# EAGLE design vlpf (EAGLE 7.2.0)
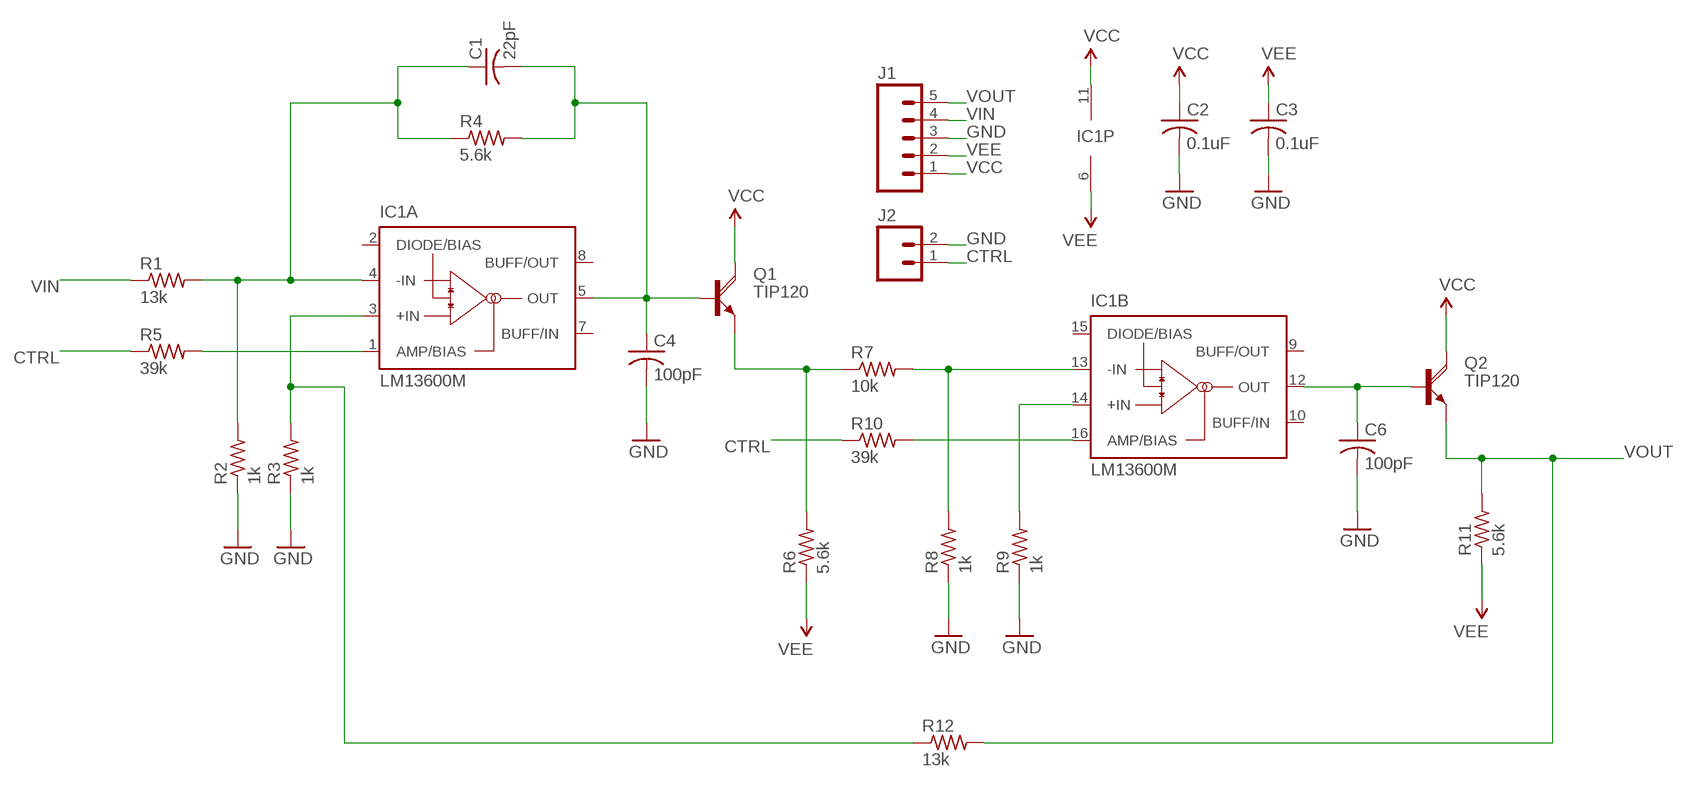
[diagram p0: schematic, sheet 1]

## Parts
C1  22pF  C-USC0504  [C0504]
C2  0.1uF  C-USC0504  [C0504]
C3  0.1uF  C-USC0504  [C0504]
C4  100pF  C-USC0504  [C0504]
C6  100pF  C-USC0504  [C0504]
IC1  LM13600M  [SO16]
J1  M05PTH  [1X05]
J2  M02PTH  [1X02]
Q1  TIP120  [TO220AH]
Q2  TIP120  [TO220AH]
R1  13k  R-US_R0402  [R0402]
R2  1k  R-US_R0402  [R0402]
R3  1k  R-US_R0402  [R0402]
R4  5.6k  R-US_R0402  [R0402]
R5  39k  R-US_R0402  [R0402]
R6  5.6k  R-US_R0402  [R0402]
R7  10k  R-US_R0402  [R0402]
R8  1k  R-US_R0402  [R0402]
R9  1k  R-US_R0402  [R0402]
R10  39k  R-US_R0402  [R0402]
R11  5.6k  R-US_R0402  [R0402]
R12  13k  R-US_R0402  [R0402]

## Nets
CTRL: J2.1 R5.1 R10.1
GND: C2.2 C3.2 C4.2 C6.2 J1.3 J2.2 R2.1 R3.1 R8.1 R9.1
N$1: C1.1 IC1.4(A:-IN) R1.2 R2.2 R4.1
N$2: IC1.3(A:+IN) R3.2 R12.1
N$3: C1.2 C4.1 IC1.5(A:OUT) Q1.B R4.2
N$4: IC1.1(A:AMP/BIAS) R5.2
N$5: Q1.E R6.2 R7.1
N$6: IC1.13(B:-IN) R7.2 R8.2
N$7: IC1.14(B:+IN) R9.2
N$8: IC1.16(B:AMP/BIAS) R10.2
N$9: C6.1 IC1.12(B:OUT) Q2.B
VCC: C2.1 IC1.11(P:V+) J1.1 Q1.C Q2.C R6.1 R11.1 ; supply symbol labelled VEE
VEE: C3.1 IC1.6(P:V-) J1.2
VIN: J1.4 R1.1
VOUT: J1.5 Q2.E R11.2 R12.2
Unconnected: IC1.2(A:DIODE/BIAS) IC1.7(A:BUFF/IN) IC1.8(A:BUFF/OUT) IC1.9(B:BUFF/OUT) IC1.10(B:BUFF/IN) IC1.15(B:DIODE/BIAS)

## Library data of the parts
C1-C4 C6 = adafruit:C-US: CAPACITOR, American symbol
IC1 = national-semiconductor:LM13600: Dual Operational Transconductance Amplifiers with Linearizing Diodes and Buffers Source: lm13600.PDF
J1 = SparkFun-Connectors:M05: Header 5 Standard 5-pin 0.1" header. Use with straight break away headers (SKU : PRT-00116), right angle break away headers (PRT-00553), swiss pins (PRT-00743), machine pins (PRT-00117), and female headers (PRT-00115). Molex polarized connector foot print use with SKU : PRT-08230 with associated crimp pins and housings.
J2 = SparkFun-Connectors:M02: Standard 2-pin 0.1" header. Use with - straight break away headers ( PRT-00116) - right angle break away headers (PRT-00553) - swiss pins (PRT-00743) - machine pins (PRT-00117) - female headers (PRT-00115) Molex polarized connector foot print use with: PRT-08233 with associated crimp pins and housings. 2.54_SCREWTERM for use with PRT-10571. 3.5mm Screw Terminal footprints for PRT-08084 5mm Screw Terminal footprints for use with PRT-08432
Q1 Q2 = transistor-power:TIP120: NPN DARLINGTON TRANSISTOR
R1-R12 = adafruit:R-US_: RESISTOR, American symbol

## Board
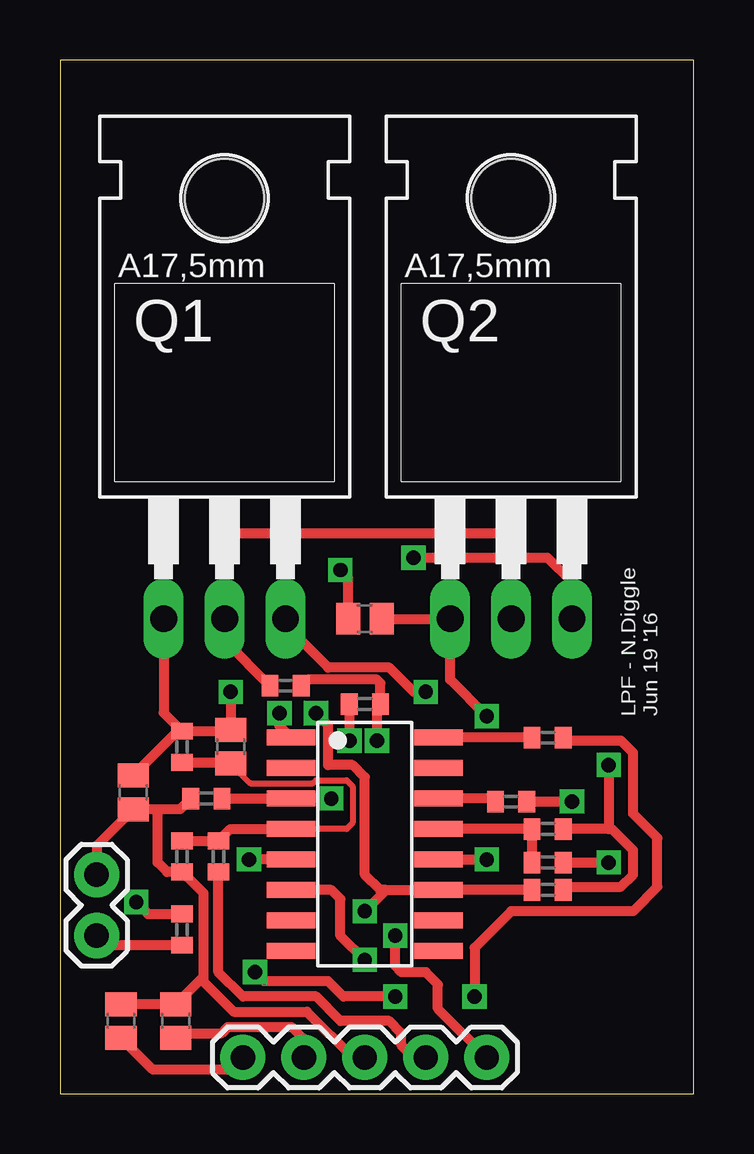
[diagram p1: board, top side]
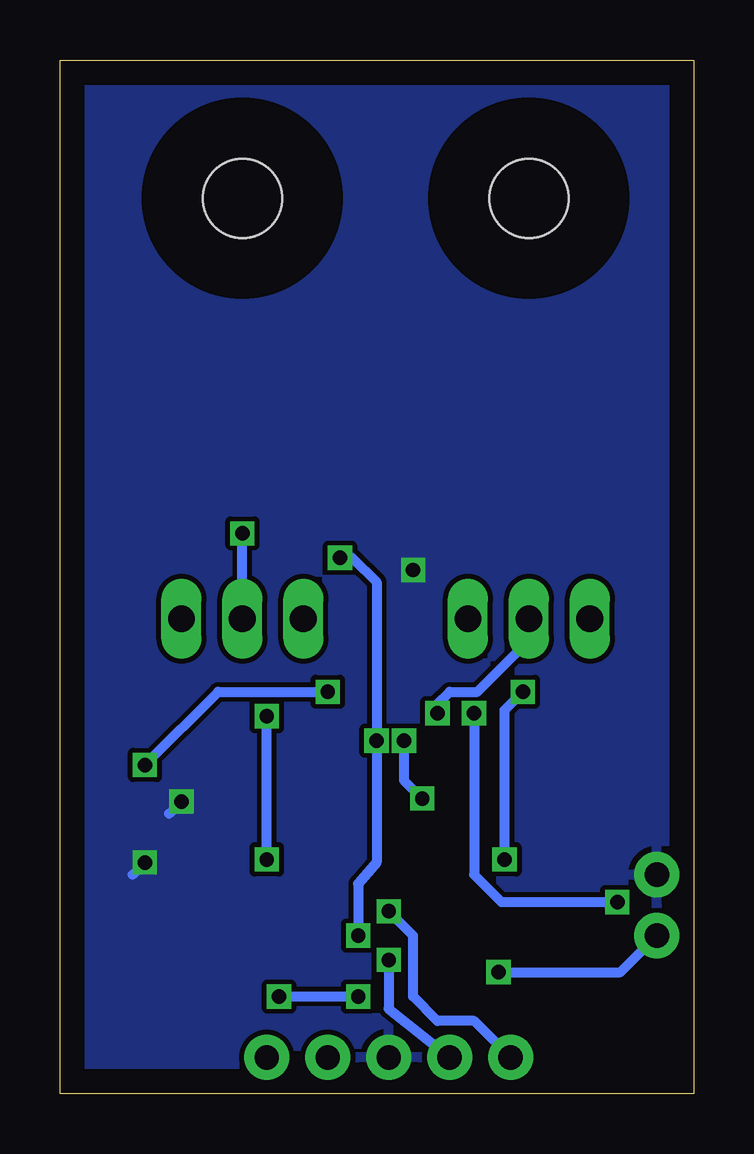
[diagram p2: board, bottom side, seen from below]

Size 26.4 x 43.1 mm. Coordinates in mm from the lower left corner, seen from the top.
Outline: 0,0 26.4,0 26.4,43.1 0,43.1 0,0
Copper layers (1*16): Top 0.035mm / dielectric 1.5mm / Bottom 0.035mm
Design rules "default": minimum track width 10mil, minimum drill 24mil, track to track 8mil, track to pad 8mil, pad to pad 8mil, via to via 8mil, smd to smd 8mil, copper to edge 40mil, drill to drill 8mil, minimum pad ring 10mil, minimum via ring 8mil, stop-mask expansion 4mil, vias tented up to drill 0mil, thermal gap 10mil

### Footprints (pad centres in the part's own frame; a part is rotated, then mirrored left to right if it is on the bottom)
C0504 = smd 1 x 1.3: 1 -0.7,0; 2 0.7,0
SO16 = smd 0.66 x 2.032: 1 -4.445,-3.073; 2 -3.175,-3.073; 3 -1.905,-3.073; 4 -0.635,-3.073; 5 0.635,-3.073; 6 1.905,-3.073; 7 3.175,-3.073; 8 4.445,-3.073; 9 4.445,3.073; 10 3.175,3.073; 11 1.905,3.073; 12 0.635,3.073; 13 -0.635,3.073; 14 -1.905,3.073; 15 -3.175,3.073; 16 -4.445,3.073
1X05 = drill 1.016 pad 1.88: 1 0,0; 2 2.54,0; 3 5.08,0; 4 7.62,0; 5 10.16,0
1X02 = drill 1.016 pad 1.88: 1 0,0; 2 2.54,0
TO220AH = drill 1.118 long: B -2.54,-6.35; C 0,-6.35; E 2.54,-6.35 | hole 3.302: 0,11.176
R0402 = smd 0.7 x 0.9: 1 -0.65,0; 2 0.65,0

### Placement (x,y rotation side)
C1  7.11,14.48 90 top
C2  2.54,3.05 90 top
C3  4.83,3.05 90 top
C4  3.05,12.57 270 top
C6  12.7,19.81 180 top
IC1  12.7,10.41 270 top
J1  7.62,1.52 0 top
J2  1.52,6.6 90 top
Q1  6.86,26.16 0 top
Q2  18.8,26.16 0 top
R1  6.6,9.91 90 top
R2  5.08,9.91 90 top
R3  6.1,12.32 0 top
R4  5.08,14.48 90 top
R5  5.08,6.86 90 top
R6  20.32,8.51 0 top
R7  20.32,11.05 180 top
R8  20.32,9.65 180 top
R9  18.8,12.19 180 top
R10  20.32,14.86 180 top
R11  9.4,17.02 0 top
R12  12.7,16.26 0 top

### Tracks (layer width: path | path; a pad name or v marks a point on that pad's centre or on a via)
CTRL  (via drill 0.6)
  Top 0.406: R5.1 1.92,6.21 J2.1 | R10.1 21.1,14.73 23.37,14.73 23.88,14.22 23.88,11.68 24.89,10.67 24.89,8.64 23.88,7.62 18.8,7.62 17.27,6.1 v17.27,4.06 | v13.97,4.06 11.81,4.06 11.18,4.7 8.51,4.7 v8.13,5.08
  Bottom 0.406: v17.27,4.06 v13.97,4.06 | v8.13,5.08 3.05,5.08 J2.1
GND  (via drill 0.6)
  Top 0.406: C2.2 C3.2 5.97,4.89 | 5.97,4.89 5.97,8.38 5.09,9.26 R2.1 4.46,9.26 4.06,9.65 4.06,11.87 | J2.2 1.52,10.35 C4.2 4.06,11.87 | R3.1 5,11.87 4.06,11.87 | C6.2 12,21.53 v11.68,21.84 | R8.1 v22.86,9.65 | R9.1 v21.34,12.19 | J1.3 12.19,1.52 10.29,3.43 7.24,3.43 5.97,4.7 5.97,4.89
  Bottom 0.406: v22.86,9.65 23.37,9.14 | v21.34,12.19 21.84,11.68
  pour Bottom: -0.51,-0.51 26.92,-0.51 26.92,43.69 -0.51,43.69
N$1
  Top 0.254: C1.1 7.94,12.95 10.54,12.95 10.67,13.08 11.94,13.08 12.19,12.83 12.19,11.3 11.94,11.05 IC1.4
  Top 0.406: IC1.4 7.1,11.05 R1.2 R2.2 | R4.1 7.06,13.83 C1.1
N$2  (via drill 0.6)
  Top 0.406: R3.2 IC1.3 v11.3,12.32 | R12.1 12.05,14.97 v12.06,14.73
  Bottom 0.406: v12.06,14.73 12.06,13.08 v11.3,12.32
N$3  (via drill 0.6)
  Top 0.406: R4.2 4.9,15.13 C4.1 | R4.2 7.06,15.13 C1.2 v7.11,16.76 | Q1.B 4.32,15.89 R4.2 | IC1.5 v7.87,9.78
  Bottom 0.406: v7.87,9.78 7.87,16 v7.11,16.76
N$4  (via drill 0.6)
  Top 0.406: IC1.1 9.14,15.34 v9.14,15.88 | v3.17,8 3.67,7.51 R5.2
  Bottom 0.406: v9.14,15.88 9.14,9.14 8,8 v3.17,8
N$5  (via drill 0.6)
  Top 0.406: R6.2 21.1,8.64 23.37,8.64 23.88,9.14 23.88,10.16 22.99,11.05 22.86,11.05 | 22.86,11.05 R7.1 | v15.24,16.76 14.73,16.76 13.72,17.78 11.18,17.78 9.4,19.56 Q1.E | v22.86,13.72 22.86,11.05
  Bottom 0.406: v22.86,13.72 19.81,16.76 v15.24,16.76
N$6
  Top 0.406: IC1.13 R7.2 R8.2
N$7
  Top 0.406: R9.2 18.02,12.32 IC1.14
N$8
  Top 0.406: R10.2 IC1.16
N$9  (via drill 0.6)
  Top 0.406: C6.1 Q2.B 16.26,17.27 v17.78,15.75 | IC1.12 v17.78,9.78
  Bottom 0.406: v17.78,9.78 v17.78,15.75
VCC  (via drill 0.6)
  Top 0.406: C2.1 3.87,1.02 7.11,1.02 J1.1 | R11.1 6.86,18.91 Q1.C 6.86,22.86 7.37,23.37 v18.8,23.37 | v12.7,7.62 13.59,8.51 | 13.59,8.51 IC1.11 R6.1 | 13.59,8.51 13.34,8.51 12.7,9.14 12.7,13.21 12.19,13.72 11.18,13.72 11.18,15.37 v10.67,15.88
  Bottom 0.406: J1.1 9.14,3.05 10.67,3.05 11.68,4.06 11.68,6.6 v12.7,7.62 | Q1.C 6.86,18.91 9,16.76 10.16,16.76 10.67,16.26 v10.67,15.88 | Q2.C v18.8,23.37
VEE  (via drill 0.6)
  Top 0.406: C3.1 4.89,2.35 5.08,2.54 6.73,2.54 6.99,2.79 9.65,2.79 10.16,2.29 J1.2 | v12.7,5.59 11.68,6.6 11.68,8.13 11.3,8.51 IC1.6
  Bottom 0.406: v12.7,5.59 12.7,3.56 J1.2
VIN
  Top 0.406: J1.4 14.73,1.52 14.22,2.03 14.22,2.54 13.72,3.05 11.68,3.05 10.67,4.06 7.62,4.06 6.6,5.08 R1.1
VOUT  (via drill 0.6)
  Top 0.406: R11.2 10.3,17.27 13.21,17.27 13.35,17.13 R12.2 13.21,16.11 v13.21,14.73 | J1.5 15.75,3.56 15.75,4.57 15.24,5.08 14.22,5.08 13.97,5.33 v13.97,6.6 | Q2.E 21.34,21.34 20.32,22.35 v14.73,22.35
  Bottom 0.406: v13.97,6.6 13.97,8.76 13.21,9.65 v13.21,14.73 13.21,21.34 14.22,22.35 v14.73,22.35

### Text on the board
tNames: LPF - N.Diggle / Jun 19 '16